# EAGLE design piezo-buffer-and-preamp-ritter_V0-3-thru (EAGLE 7.5.0)
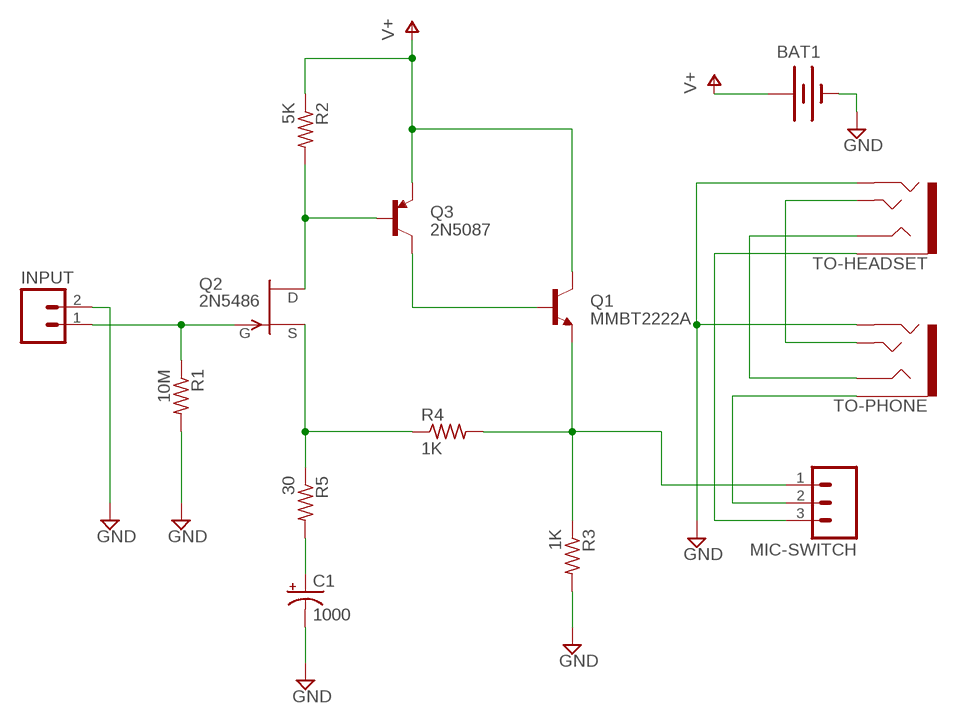
[diagram p0: schematic, sheet 1]

## Parts
BAT1  BATTERYAAA-KIT  [BATTERY-AAA-KIT]
C1  1000  CAP_POLPTH4  [CPOL-RADIAL-1000UF-25V]
INPUT  M02LOCK  [1X02_LOCK]
MIC-SWITCH  M03LOCK  [1X03_LOCK]
Q1  MMBT2222A  TRANSISTOR_NPNTO92  [TO-92]
Q2  2N5486  [TO92-]
Q3  2N5087  TRANSISTOR_PNPTO92  [TO-92]
R1  10M  R-US_V526-0  [V526-0]
R2  5K  R-US_V526-0  [V526-0]
R3  1K  R-US_V526-0  [V526-0]
R4  1K  R-US_V526-0  [V526-0]
R5  30  R-US_V526-0  [V526-0]
TO-HEADSET  AUDIO-JACK3  [AUDIO-JACK-TRRS-SMD]
TO-PHONE  AUDIO-JACK3  [AUDIO-JACK-TRRS-SMD]

## Nets
`DEL: MIC-SWITCH.1 Q1.1(E) R3.1 R4.2
GND: BAT1.GND@1(-) C1.- INPUT.2 R1.2 R3.2 TO-HEADSET.RING2 TO-PHONE.RING2
N$1: INPUT.1 Q2.1(G) R1.1
N$2: Q2.3(D) Q3.2(B) R2.2
N$4: Q2.2(S) R4.1 R5.1
N$5: Q1.2(B) Q3.3(C)
N$6: C1.+ R5.2
N$7: MIC-SWITCH.3 TO-HEADSET.EARTH
N$8: TO-HEADSET.TIP TO-PHONE.TIP
N$9: TO-HEADSET.RING1 TO-PHONE.RING1
TO-PHONE: MIC-SWITCH.2 TO-PHONE.EARTH
V+: BAT1.PWR@1(+) Q1.3(C) Q3.1(E) R2.1

## Library data of the parts
BAT1 = Daniel:BATTERY: Battery Holders Various common sizes : AA, AAA, 18650 (PRT-12895), 20mm coin cell and 12mm coin cell. 20MM_4LEGS, BATT-10373; PROD_ID: BATT-08571
C1 = SparkFun-Capacitors:CAP_POL: Capacitor Polarized These are standard SMD and PTH capacitors. Normally 10uF, 47uF, and 100uF in electrolytic and tantalum varieties. Always verify the external diameter of the through hole cap, it varies with capacity, voltage, and manufacturer. The EIA devices should be standard.
INPUT = CMU-ArtFab:M02: Header 2 Standard 2-pin 0.1" header. Use with straight break away headers (SKU : PRT-00116), right angle break away headers (PRT-00553), swiss pins (PRT-00743), machine pins (PRT-00117), and female headers (PRT-00115). Molex polarized connector foot print use with SKU : PRT-08233 with associated crimp pins and housings.
MIC-SWITCH = SparkFun-Connectors:M03: Header 3 Standard 3-pin 0.1" header. Use with straight break away headers (SKU : PRT-00116), right angle break away headers (PRT-00553), swiss pins (PRT-00743), machine pins (PRT-00117), and female headers (PRT-00115). Molex polarized connector foot print use with SKU : PRT-08232 with associated crimp pins and housings.
Q1 = CMU-ArtFab:TRANSISTOR_NPN: Generic NPN BJT MMBT2222A - TRANS-08049 (SOT-23, 1A 40V) MPSA42 - TRANS-09116 (SOT-23, 500mA 300V) MMBT5088LT1G - TRANS-11160 (SOT-23, 50 mA 30V) BC547 - COM-08928 <http://www.sparkfun.com/products/8928> (TO-92 45V 100mA) (1.Collector 2.Base 3.Emitter) 2N3904 - COM-00521 <http://www.sparkfun.com/products/521> (TO-92 40V 200mA) (1.Emitter 2.Base 3.Collector) P2N2222A - COM-12852 <http://www.sparkfun.com/products/12852> (TO-92 40V 600mA) (1.Collector 2.Base 3.Emitter)
Q2 = transistor-fet:?548*: N-Channel JFETs Source: VISHAY 2N5484.pdf Compatible: TO92 2N5245 J304 J305 U310 J308 J309 J310 TO72 2N4416 2N4416A 2N3823 2N4351 3N169 3N170 3N171 MFE3002 TO18 2N3796 2N3797 MFE825 Source: Motorola European Master Guide Pacge 3-59
Q3 = CMU-ArtFab:TRANSISTOR_PNP: Generic PNP BJT Double check pinouts against datasheets- not all devices are the same! MMBT3906 - 40V 200mA SOT-23 (TRANS-08052) MMBT4403 - 40V 600mA SOT-23 (TRANS-09245)
R1-R5 = resistor:R-US_: RESISTOR, American symbol
TO-HEADSET TO-PHONE = SparkFun-Connectors:AUDIO-JACK3: Audio jack - 3.5mm TRRS variety - two rings.

## Board
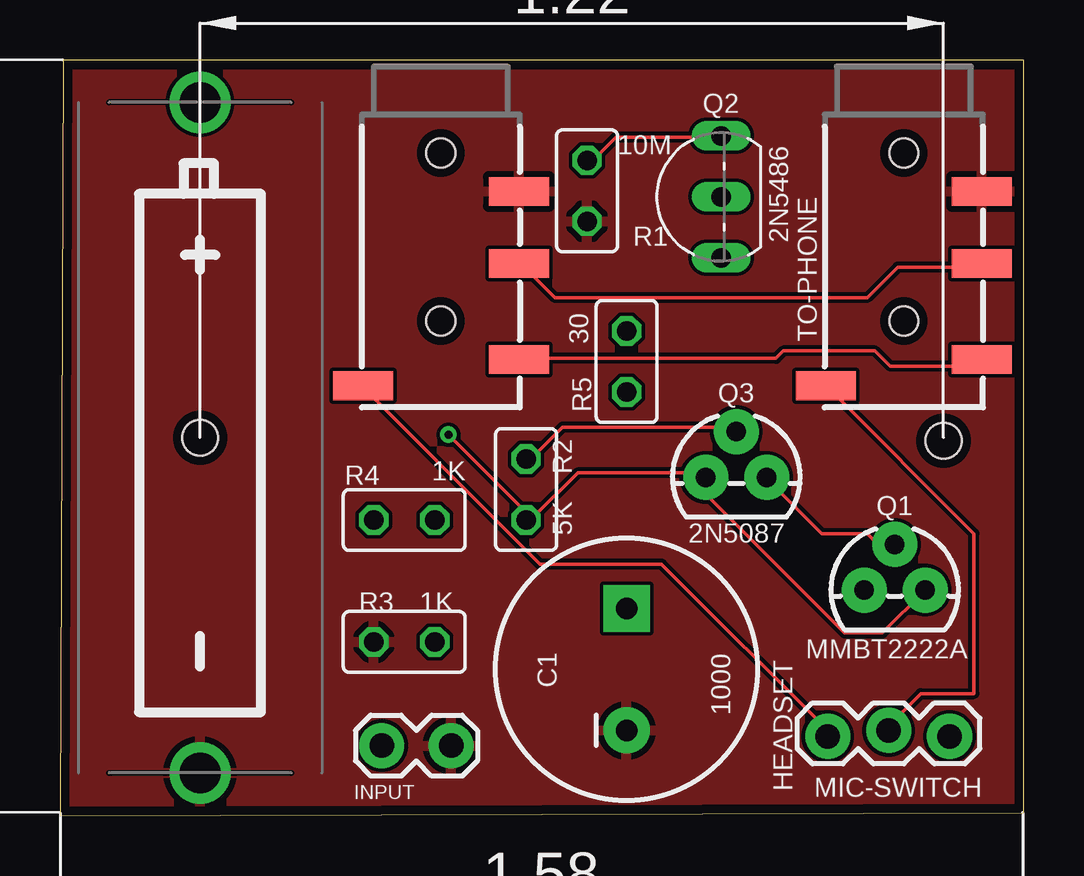
[diagram p1: board, top side]
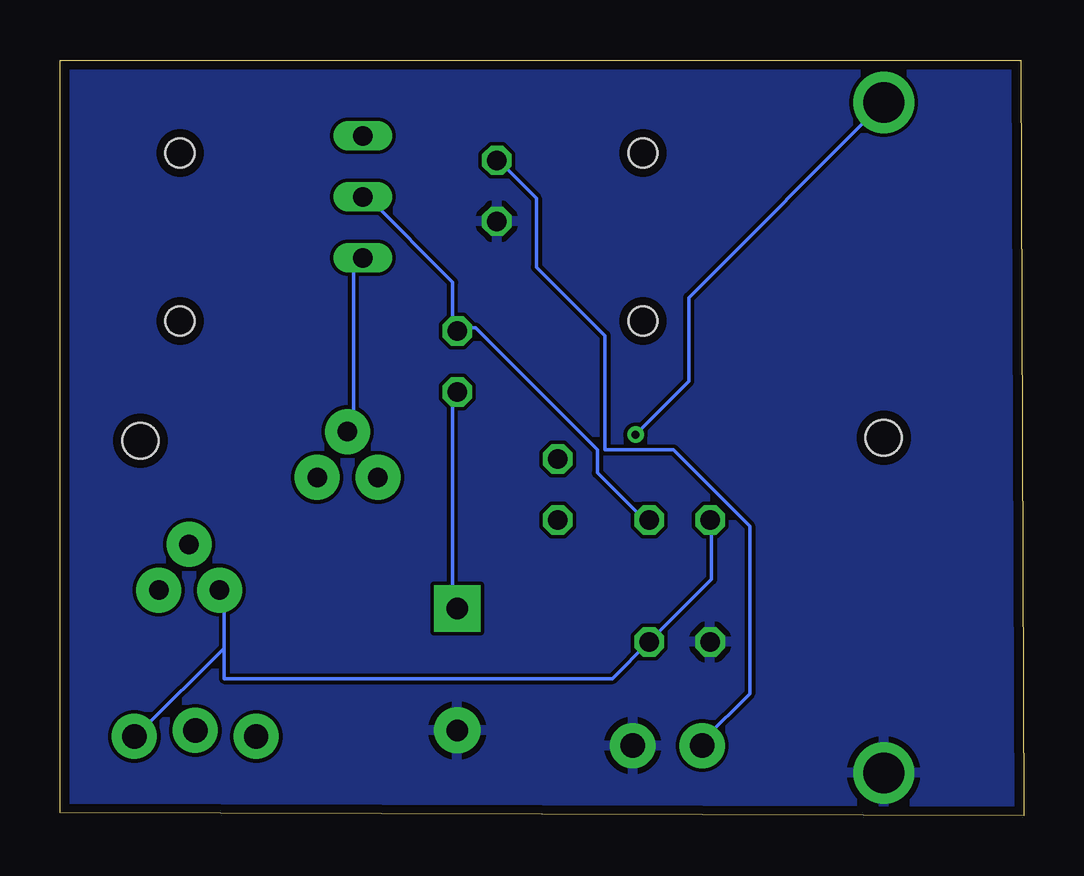
[diagram p2: board, bottom side, seen from below]

Size 40.18 x 31.49 mm. Coordinates in mm from the lower left corner, seen from the top.
Outline: 0,0 40.18,0.13 40.18,31.49 0.13,31.49 0,0
Copper layers (1*16): Top 0.0356mm / dielectric 1.5011mm / Bottom 0.0356mm
Design rules "oshpark-2layer": minimum track width 6mil, minimum drill 13mil, track to track 6mil, track to pad 6mil, pad to pad 6mil, via to via 6mil, smd to smd 6mil, copper to edge 15mil, drill to drill 6mil, minimum pad ring 7mil, minimum via ring 7mil, stop-mask expansion 2.5mil, vias tented up to drill 0mil, thermal gap 10mil
Holes 1.5 mm at 36.83,15.62 5.84,15.75

### Footprints (pad centres in the part's own frame; a part is rotated, then mirrored left to right if it is on the bottom)
BATTERY-AAA-KIT = drill 1.702: GND@1 13.97,0; PWR@1 -13.97,0
CPOL-RADIAL-1000UF-25V = drill 0.9 pad 1.93 square: + 2.54,0 | drill 0.9 pad 1.93: - -2.54,0
1X02_LOCK = drill 1.016 pad 1.88: 1 -0.178,0; 2 2.718,0
1X03_LOCK = drill 1.016 pad 1.88: 1 0,0.127; 2 2.54,-0.127; 3 5.08,0.127
TO-92 = drill 0.813 pad 1.88: 1 -1.27,0; 2 0,1.905; 3 1.27,0
TO92- = drill 0.813 long: 1 2.54,0; 2 0,0; 3 -2.54,0
V526-0 = drill 0.813 octagon: 1 -1.27,0; 2 1.27,0
AUDIO-JACK-TRRS-SMD = smd 1.2 x 2.5: EARTH 11.3,-3.25; RING1 6.2,3.25; RING2 3.2,3.25; TIP 10.2,3.25 | hole 1.2: 1.6,0; 8.6,0

### Placement (x,y rotation side)
BAT1  5.84,15.75 270 top
C1  23.62,6.1 90 top
INPUT  13.59,2.92 0 top
MIC-SWITCH  37.08,3.43 180 top
Q1  34.8,9.4 0 top
Q2  27.56,25.78 90 top
Q3  28.19,14.1 0 top
R1  21.97,26.04 270 top
R2  19.43,13.59 90 top
R3  14.35,7.24 180 top
R4  14.35,12.32 180 top
R5  23.62,18.92 270 top
TO-HEADSET  15.88,29.21 270 top
TO-PHONE  35.18,29.21 270 top

### Tracks (layer width: path | path; a pad name or v marks a point on that pad's centre or on a via)
`DEL
  Bottom 0.152: R4.2 13.02,12.06 13.02,9.84 R3.1 17.14,5.71 33.34,5.71 33.34,6.99 | 33.34,6.99 36.83,3.49 MIC-SWITCH.1 | 33.34,6.99 33.34,9.21 Q1.1
GND
  pour Top: 0,0.13 40.13,0.13 40.13,31.11 0,31.11
  pour Bottom: 0,0.13 40.13,0.13 40.13,31.11 0,31.11
N$1
  Top 0.152: R1.1 22.23,27.3 23.18,28.26 27.3,28.26 Q2.1
  Bottom 0.152: INPUT.1 13.34,3.17 11.43,5.08 11.43,12.06 14.61,15.24 17.46,15.24 17.46,20 20.32,22.86 20.32,25.72 21.91,27.3 R1.1
N$2
  Top 0.152: R2.2 19.68,14.92 20.95,16.19 27.94,16.19 Q3.2
  Bottom 0.152: Q2.3 27.94,22.86 27.94,16.19 Q3.2
N$4
  Bottom 0.152: R4.1 15.88,12.38 17.78,14.29 17.78,15.24 22.86,20.32 23.5,20.32 R5.1 23.81,20.32 23.81,22.23 27.3,25.72 Q2.2
N$5
  Top 0.152: Q3.3 29.53,13.97 31.75,11.75 33.66,11.75 33.97,11.43 34.61,11.43 Q1.2
N$6
  Bottom 0.152: R5.2 23.81,17.46 23.81,8.89 C1.+
N$7
  Top 0.152: TO-HEADSET.EARTH 12.7,17.78 20,10.48 25.08,10.48 32.07,3.49 MIC-SWITCH.3
N$8
  Top 0.152: TO-HEADSET.TIP 19.37,19.05 29.84,19.05 30.16,19.37 33.97,19.37 34.61,18.73 38.42,18.73 TO-PHONE.TIP
N$9
  Top 0.152: TO-HEADSET.RING1 19.37,22.86 20.64,21.59 33.66,21.59 34.92,22.86 38.42,22.86 TO-PHONE.RING1
TO-PHONE
  Top 0.152: TO-PHONE.EARTH 32.07,17.78 38.1,11.75 38.1,5.08 35.88,5.08 34.61,3.81 MIC-SWITCH.2
V+  (via drill 0.33)
  Top 0.152: 19.68,12.38 21.59,14.29 26.04,14.29 | 26.04,14.29 26.67,14.29 Q3.1 26.04,14.29 | Q1.3 34.29,7.62 32.7,7.62 26.04,14.29 | 19.68,12.38 v16.19,15.88 | 19.68,12.38 R2.1
  Bottom 0.152: BAT1.PWR@1 13.97,21.59 13.97,18.1 v16.19,15.88